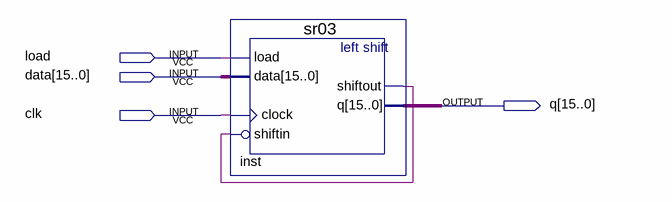
[diagram p0: schematic sheet]
// Quartus schematic b03.bdf as structural Verilog: 1 symbols, 4 pins
module b03 (
  input  load,
  input  [15:0] data,
  input  clk,
  output [15:0] q
);

  wire inst_shiftout;

  sr03 inst (.clock(clk), .data(data), .load(load), .shiftin(~inst_shiftout), .q(q), .shiftout(inst_shiftout));
endmodule
